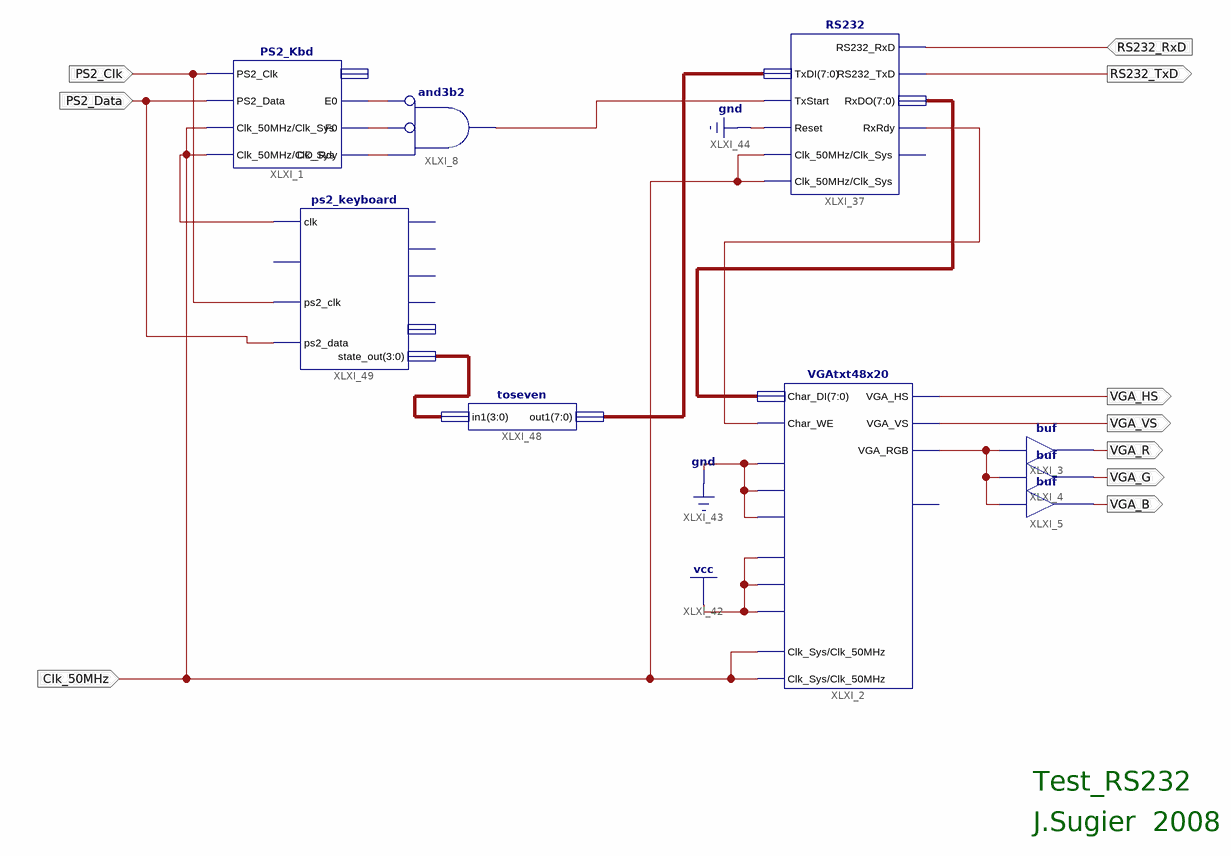
[diagram p0: schematic sheet 1]
// Xilinx ISE schematic Test_RS232.sch (spartan3e) as structural Verilog: 9 symbols, 10 ports
module Test_RS232 (
  input  RS232_RxD,
  input  PS2_Clk,
  input  PS2_Data,
  input  Clk_50MHz,
  output RS232_TxD,
  output VGA_HS,
  output VGA_VS,
  output VGA_R,
  output VGA_G,
  output VGA_B
);

  wire XLXN_8, XLXN_15, XLXN_16, XLXN_17, XLXN_100, XLXN_125;
  wire [3:0] XLXN_140;
  wire [7:0] XLXN_101, XLXN_143;

  RS232 XLXI_37 (
    .Clk_50MHz(Clk_50MHz), .Reset(1'b0), .RS232_RxD(RS232_RxD), .TxStart(XLXN_125), .TxDI(XLXN_143),
    .RxRdy(XLXN_100), .RS232_TxD(RS232_TxD), .RxDO(XLXN_101), .Clk_Sys(Clk_50MHz));  // open: TxBusy
  VGAtxt48x20 XLXI_2 (
    .Char_DI(XLXN_101), .Home(1'b0), .NewLine(1'b0), .Goto00(1'b0), .Clk_Sys(Clk_50MHz),
    .Clk_50MHz(Clk_50MHz), .CursorOn(1'b1), .ScrollEn(1'b1), .ScrollClear(1'b1), .VGA_HS(VGA_HS),
    .VGA_VS(VGA_VS), .VGA_RGB(XLXN_8), .Char_WE(XLXN_100));  // open: Busy
  buf XLXI_3 (VGA_R, XLXN_8);
  buf XLXI_4 (VGA_G, XLXN_8);
  buf XLXI_5 (VGA_B, XLXN_8);
  PS2_Kbd XLXI_1 (
    .PS2_Clk(PS2_Clk), .PS2_Data(PS2_Data), .Clk_50MHz(Clk_50MHz), .E0(XLXN_15), .F0(XLXN_16),
    .DO_Rdy(XLXN_17), .Clk_Sys(Clk_50MHz));  // open: DO
  and XLXI_8 (XLXN_125, ~XLXN_15, ~XLXN_16, XLXN_17);  // and3b2
  toseven XLXI_48 (.in1(XLXN_140), .out1(XLXN_143));
  ps2_keyboard XLXI_49 (
    .clk(Clk_50MHz), .ps2_clk(PS2_Clk), .ps2_data(PS2_Data), .state_out(XLXN_140));  // open: reset, set_rng, reset_out, set_q, check, answer

  // Notes on the sheet:
  //   Test_RS232
  //   J.Sugier  2008
endmodule
